# Altium schematic sheet 2  - Battery Sensing and Control.SchDoc
size A4
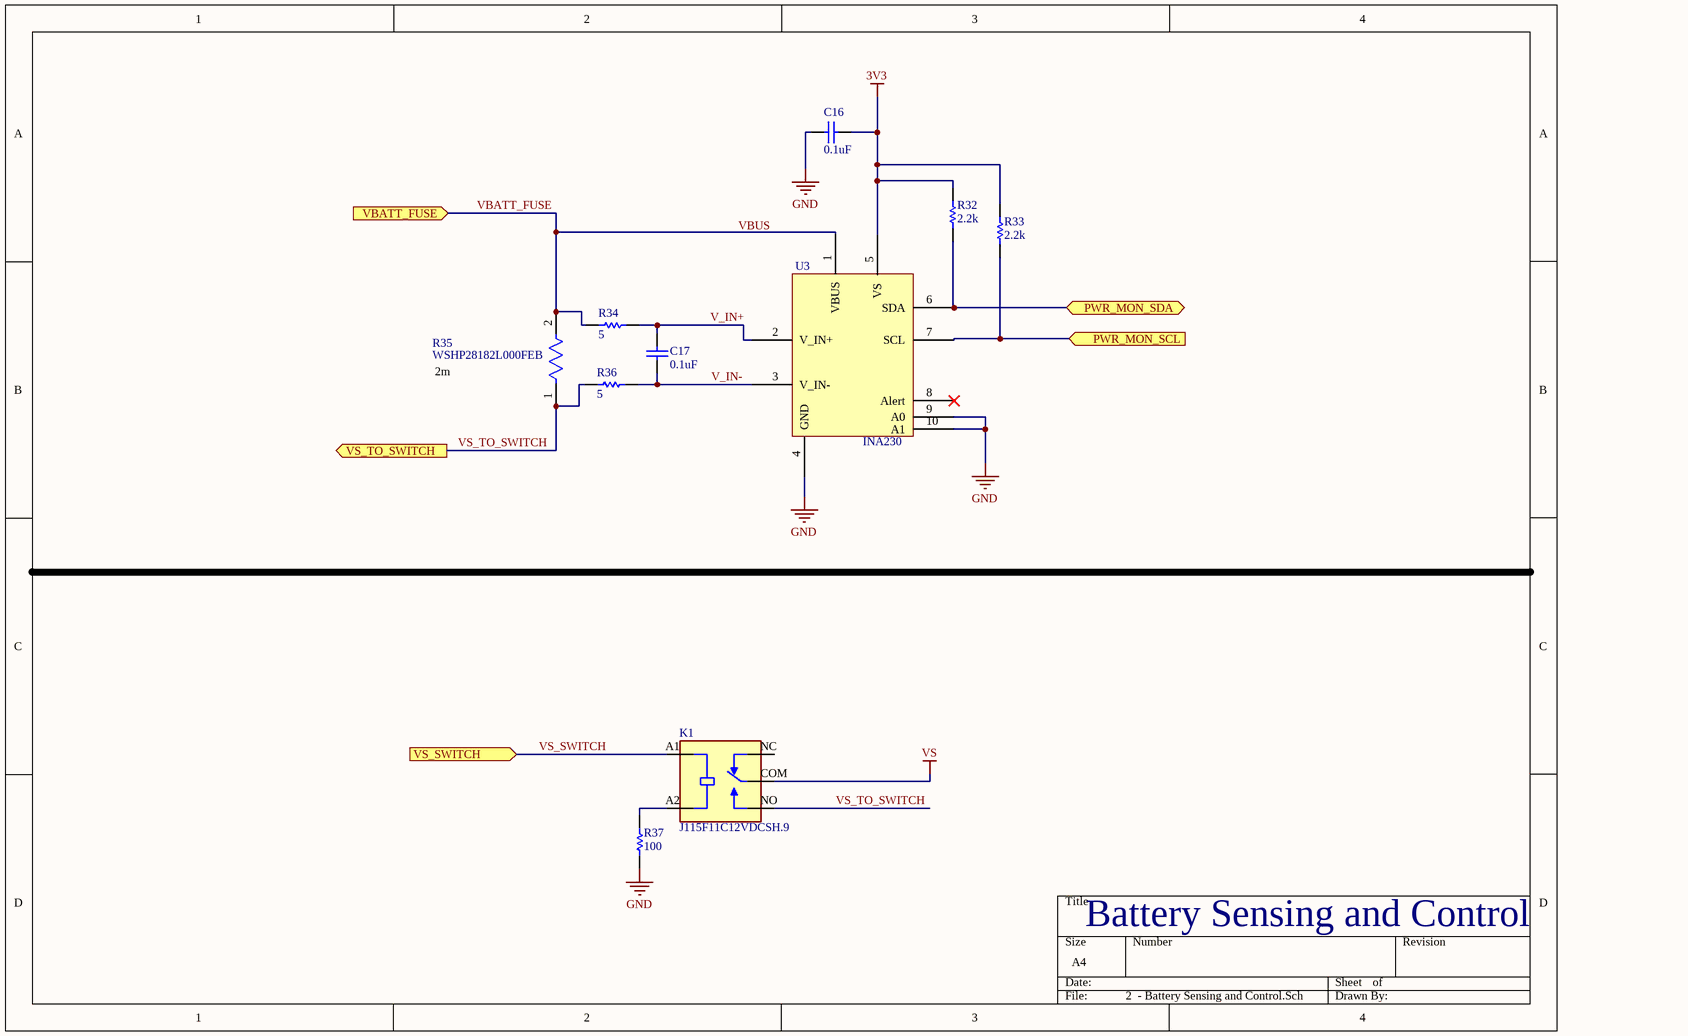
[diagram p0: 2  - Battery Sensing and Control.SchDoc]

## Parts
C16  value 0.1uF  [0603R-generic]  (hidden comment: Cap)
C17  value 0.1uF  [0603R-generic]  (hidden comment: Cap)
K1  J115F11C12VDCSH.9  [RELAY_J115F11C12VDCSH.9]
R32  2.2k  [RESC0603(1608)_L]
R33  2.2k  [RESC0603(1608)_L]
R34  5  [RESC0603(1608)_L]
R35  WSHP28182L000FEB  [FP-WSHP2818-MFG]
R36  5  [RESC0603(1608)_L]
R37  100  [RESC0603(1608)_L]
U3  INA230  [SOP50P490X110-10N]

## Ports
PWR_MON_SCL (in), PWR_MON_SDA (bidir), VBATT_FUSE (in), VS_SWITCH (in), VS_TO_SWITCH (out)

## Nets
3V3: C16.1 R32.2 R33.2 U3.5(VS)
GND: C16.2 R37.2 U3.4(GND) U3.9(A0) U3.10(A1)
VS: K1.COM
PWR_MON_SCL: R33.1 U3.7(SCL) ; port PWR_MON_SCL
PWR_MON_SDA: R32.1 U3.6(SDA) ; port PWR_MON_SDA
V_IN+: C17.2 R34.1 U3.2(V_IN+)
V_IN-: C17.1 R36.1 U3.3(V_IN-)
VBATT_FUSE: R34.2 R35.2 U3.1(VBUS) ; port VBATT_FUSE
VS_SWITCH: K1.A1(COIL1) ; port VS_SWITCH
VS_TO_SWITCH: K1.NO R35.1 R36.2 ; port VS_TO_SWITCH
NetK1_A2: K1.A2(COIL2) R37.1

Not connected (* = marked no-connect by the designer): K1 NC; U3 8(Alert)*

## Notes on the sheet
- 2m
- Battery Sensing and Control
- Labels drawn without touching a wire or pin: VBUS

## Library data of the parts
C16 C17 = Cap: Capacitor; Manufacturer: Yageo; Manufacturer Part Number: CC1210ZKY5V8BB106; Capacitance: 10µF; Tolerance: -20%, +80%; Voltage - Rated: 25V; Temperature Coefficient: Y5V (F); Supplier 1: Digi-Key; Supplier Part Number 1: 311-2063-1-ND; RoHS: RoHS Compliant; Category: Capacitors; Stock 1: 1156; Pricing 1: 1=0.47, 10=0.323, 25=0.258, 50=0.2154, 100=0.1829, 250=0.14528, 500=0.12912, 1000=0.11298 (CAD); Packaging: Cut Tape (CT); Part Status: Active; Operating Temperature: -30°C ~ 85°C; Features: -; Ratings: -; Applications: General Purpose; Failure Rate: -; Mounting Type: Surface Mount, MLCC; Package / Case: 1210 (3225 Metric); Size / Dimension: 0.126" L x 0.098" W (3.20mm x 2.50mm); Height - Seated (Max): -; Thickness (Max): 0.083" (2.10mm); Lead Spacing: -; Lead Style: -; ComponentLink1URL: http://www.yageo.com/documents/recent/UPY-GPHC_Y5V_6.3V-to-50V_7.pdf; ComponentLink1Description: http://www.yageo.com/documents/recent/UPY-GPHC_Y5V_6.3V-to-50V_7.pdf; Supplier 2: Digi-Key; Supplier Part Number 2: 1276-1869-1-ND
K1 = J115F11C12VDCSH.9: General Purpose Relay SPDT (1 Form C) 12VDC Coil Through Hole; MF: CIT Relay and Switch; Availability: In Stock; SnapEDA_Link: https://www.snapeda.com/parts/J115F11C12VDCSH.9/CIT+Relay+%2526+Switch/view-part/?ref=snap; MP: J115F11C12VDCSH.9; Value: *; Price: None; Package: None; Purchase-URL: https://pricing.snapeda.com/search/part/J115F11C12VDCSH.9/?ref=eda; Check_prices: https://www.snapeda.com/parts/J115F11C12VDCSH.9/CIT+Relay+%2526+Switch/view-part/?ref=eda
R32-R34 R36 R37 = CMP-1591-00001-1: 0603 (1608 Metric) Chip Resistor; Case-Metric: 1608; Case-EIA: 0603; PackageReference: RESC0603(1608); Supplier 1: Digi-Key; Supplier Part Number 1: P430BZCT-ND
R35 = CMP-00030-78727543-1: WSHP28182L000FEB Res Metal Strip 2818 0.002 Ohm 1% 10W ±200ppm/C Pad SMD Automotive T/R; Temperature Coefficient: 200ppm/°C; Resistance: 2mΩ; Case/Package: 2818; Packaging: Cut Tape; NexarPartId: 78727543; Composition: Metal Element; Height: 3.43mm; Power Rating: 10W; Min Operating Temperature: -65°C; Schedule B: 8533210045, 8533210045; Max Operating Temperature: 170°C; Tolerance: 1%; RoHS: Non-Compliant